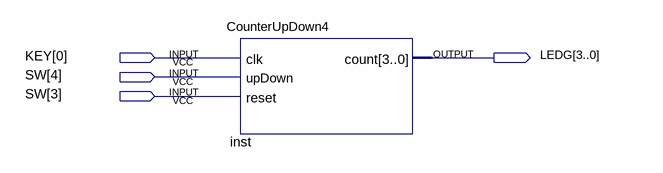
[diagram p0: schematic sheet]
// Quartus schematic Counter_Demo.bdf as structural Verilog: 1 symbols, 4 pins
module Counter_Demo (
  input  [0:0] KEY,
  input  [4:3] SW,
  output [3:0] LEDG
);

  CounterUpDown4 inst (.clk(KEY[0]), .upDown(SW[4]), .reset(SW[3]), .count(LEDG));
endmodule
